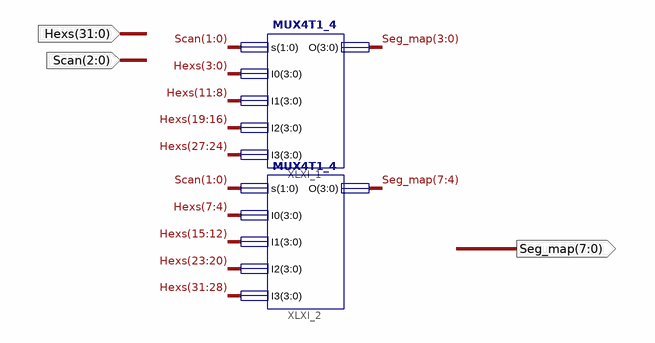
[diagram p0: schematic sheet 1]
// Xilinx ISE schematic Seg_map.sch (kintex7) as structural Verilog: 2 symbols, 3 ports
module Seg_map (
  input  [31:0] Hexs,
  input  [2:0] Scan,
  output [7:0] Seg_map
);

  MUX4T1_4 XLXI_1 (
    .I0(Hexs[3:0]), .I1(Hexs[11:8]), .I2(Hexs[19:16]), .I3(Hexs[27:24]), .s(Scan[1:0]), .O(Seg_map[3:0]));
  MUX4T1_4 XLXI_2 (
    .I0(Hexs[7:4]), .I1(Hexs[15:12]), .I2(Hexs[23:20]), .I3(Hexs[31:28]), .s(Scan[1:0]), .O(Seg_map[7:4]));
endmodule
